# EAGLE schematic prog_board (EAGLE 5.01)
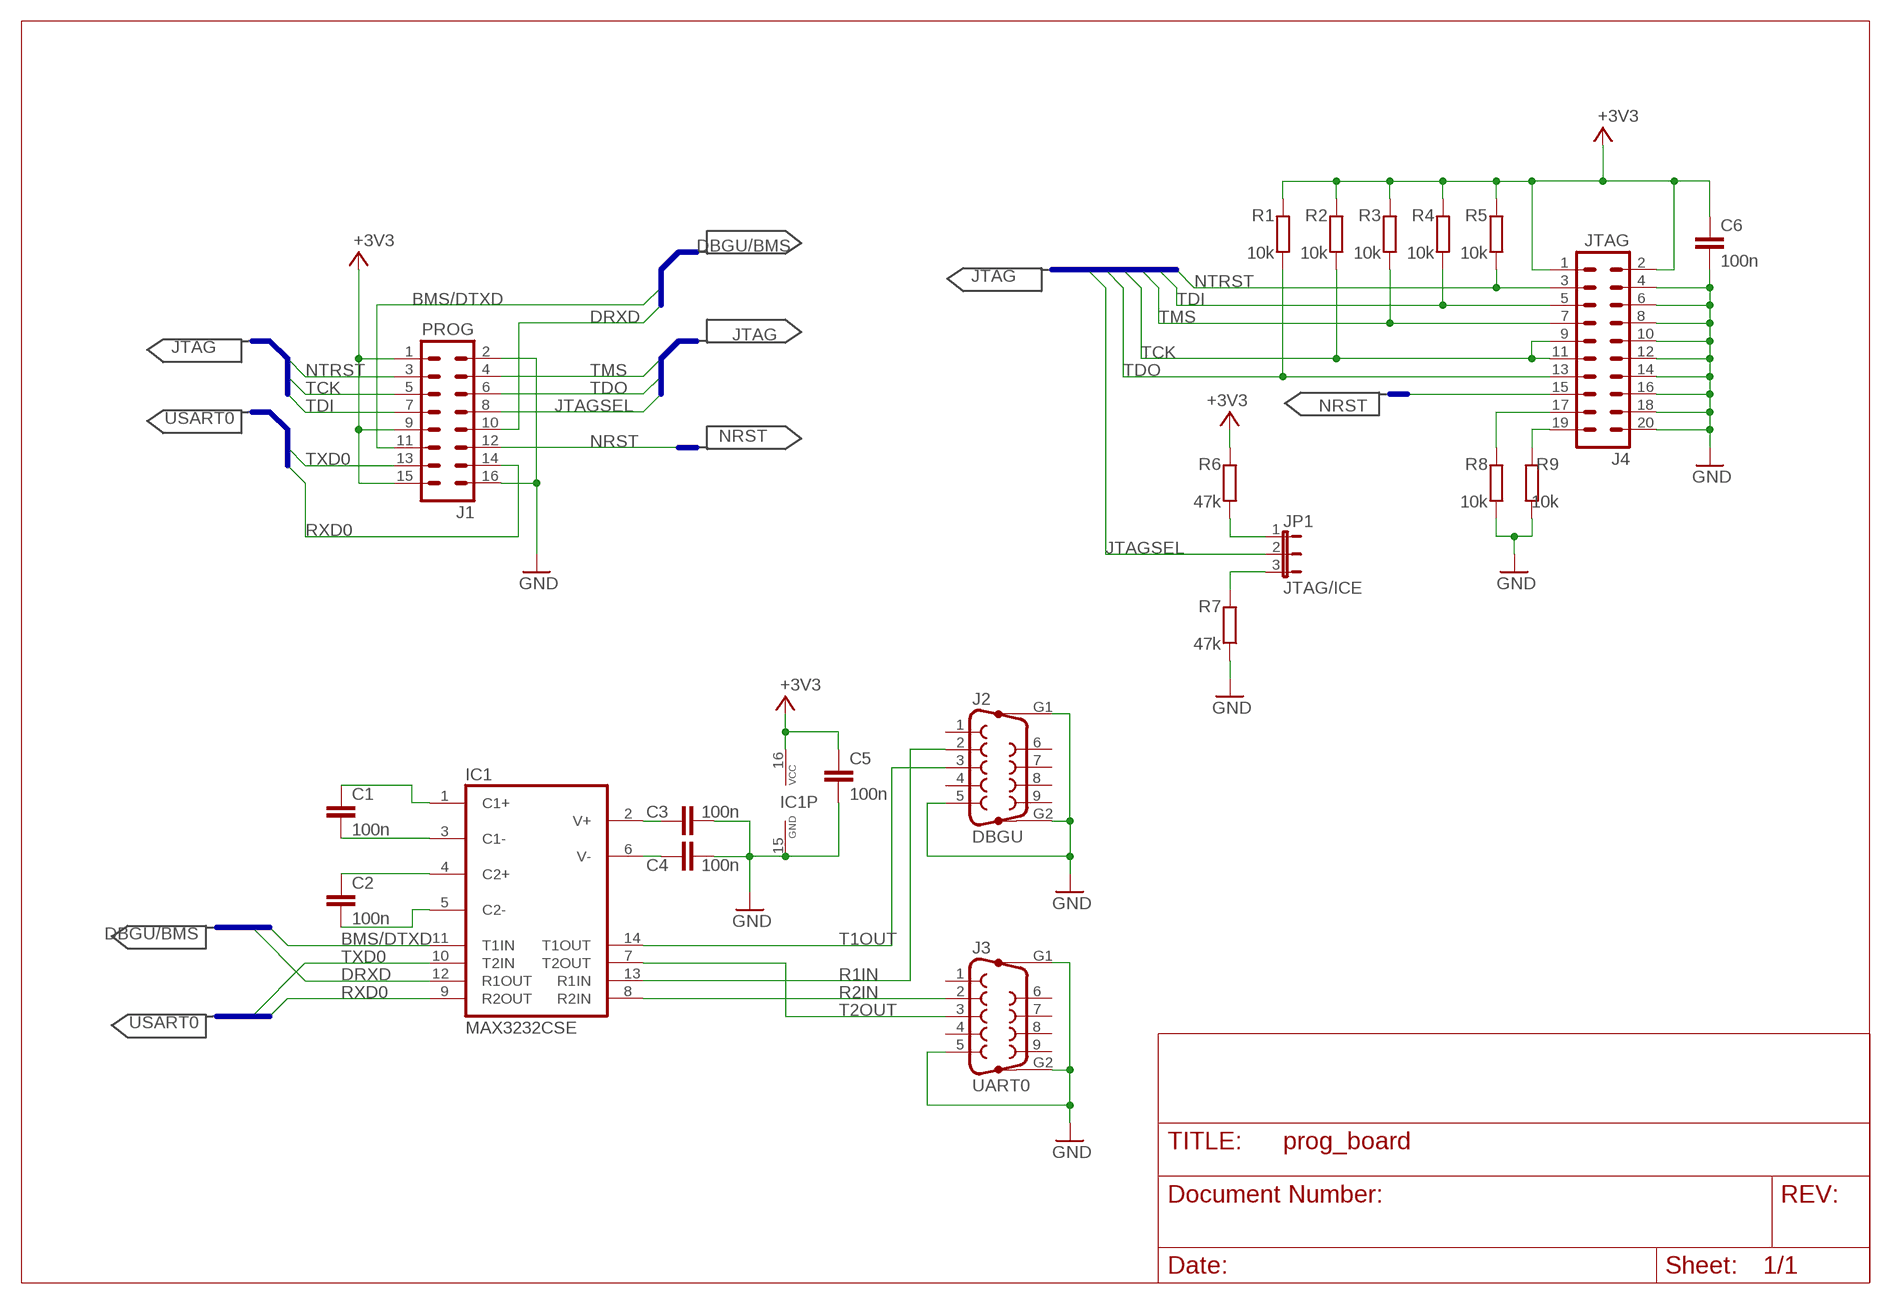
[diagram p0: schematic, sheet 1]

## Parts
C1  100n  C-EUC0603K  [C0603K]
C2  100n  C-EUC0603K  [C0603K]
C3  100n  C-EUC0603K  [C0603K]
C4  100n  C-EUC0603K  [C0603K]
C5  100n  C-EUC0603K  [C0603K]
C6  100n  C-EUC0603K  [C0603K]
IC1  MAX3232CSE  [SO16]
J1  PROG  ML16  [ML16]
J2  DBGU  F09HP  [F09HP]
J3  UART0  F09HP  [F09HP]
J4  JTAG  ML20  [ML20]
JP1  JTAG/ICE  JP2E  [JP2]
R1  10k  R-EU_R0603  [R0603]
R2  10k  R-EU_R0603  [R0603]
R3  10k  R-EU_R0603  [R0603]
R4  10k  R-EU_R0603  [R0603]
R5  10k  R-EU_R0603  [R0603]
R6  47k  R-EU_R0805  [R0805]
R7  47k  R-EU_R0805  [R0805]
R8  10k  R-EU_R0603  [R0603]
R9  10k  R-EU_R0603  [R0603]

## Nets
+3V3: C5.1 C6.1 IC1.16(VCC) J1.1 J1.9 J1.15 J4.1 J4.2 R1.2 R2.2 R3.2 R4.2 R5.2 R6.2
BMS/DTXD: IC1.11(T1IN) J1.11
DRXD: IC1.12(R1OUT) J1.10
GND: C3.2 C4.2 C5.2 C6.2 IC1.15(GND) J1.2 J1.16 J2.5 J2.G1 J2.G2 J3.5 J3.G1 J3.G2 J4.4 J4.6 J4.8 J4.10 J4.12 J4.14 J4.16 J4.18 J4.20 R7.1 R8.1 R9.1
JTAGSEL: J1.8 JP1.2
N$1: JP1.1 R6.1
N$2: JP1.3 R7.2
N$4: J4.17 R8.2
N$5: J4.19 R9.2
N$52: C1.1 IC1.1(C1+)
N$53: C2.2 IC1.5(C2-)
N$54: C2.1 IC1.4(C2+)
N$55: C1.2 IC1.3(C1-)
N$58: C3.1 IC1.2(V+)
N$59: C4.1 IC1.6(V-)
NRST: J1.12 J4.15
NTRST: J1.3 J4.3 R5.1
R1IN: IC1.13(R1IN) J2.2
R2IN: IC1.8(R2IN) J3.2
RXD0: IC1.9(R2OUT) J1.14
T1OUT: IC1.14(T1OUT) J2.3
T2OUT: IC1.7(T2OUT) J3.3
TCK: J1.5 J4.9 J4.11 R2.1
TDI: J1.7 J4.5 R4.1
TDO: J1.6 J4.13 R1.1
TMS: J1.4 J4.7 R3.1
TXD0: IC1.10(T2IN) J1.13
Unconnected: J2.1 J2.4 J2.6 J2.7 J2.8 J2.9 J3.1 J3.4 J3.6 J3.7 J3.8 J3.9

## Buses
TDI,TDO,TMS,TCK,NTRST,JTAGSEL
DRXD,BMS/DTXD
TXD0,RXD0,SCK0,CTS0,RTS0
NRST

## Notes on the sheet
- DBGU/BMS
- JTAG
- JTAG | JTAG
- USART0 | NRST
- NRST
- DBGU/BMS
- USART0

## Library data of the parts
C1-C6 = rcl:C-EU: CAPACITOR, European symbol
IC1 = maxim:MAX3232*: True RS-232 Transceivers 3.0V to 5.5V, Low-Power up to 1Mbps, Using Four 0.1µF External Capacitors Source: http://pdfserv.maxim-ic.com/en/ds/MAX3222-MAX3241.pdf
J1 = con-harting-ml:ML16: HARTING
J2 J3 = con-subd:F09HP: SUB-D
J4 = con-harting-ml:ML20: HARTING
JP1 = jumper:JP2E: JUMPER
R1-R9 = rcl:R-EU_: RESISTOR, European symbol